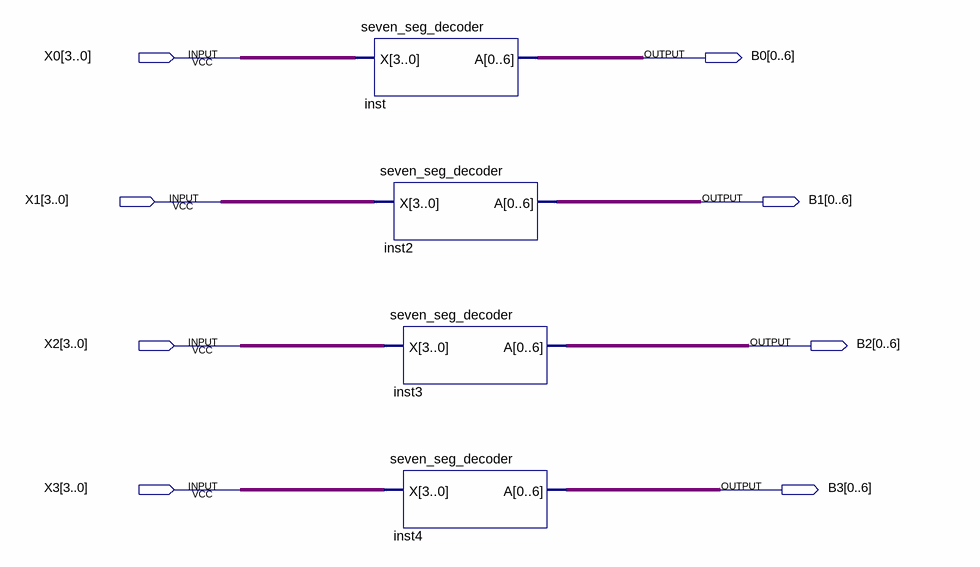
[diagram p0: schematic sheet]
// Quartus schematic lab5step1.bdf as structural Verilog: 4 symbols, 8 pins
module lab5step1 (
  input  [3:0] X0,
  input  [3:0] X1,
  input  [3:0] X2,
  input  [3:0] X3,
  output [0:6] B0,
  output [0:6] B1,
  output [0:6] B2,
  output [0:6] B3
);

  seven_seg_decoder inst (.X(X0), .A(B0));
  seven_seg_decoder inst2 (.X(X1), .A(B1));
  seven_seg_decoder inst3 (.X(X2), .A(B2));
  seven_seg_decoder inst4 (.X(X3), .A(B3));
endmodule
